# EAGLE design dRGBblades (EAGLE 6.4)
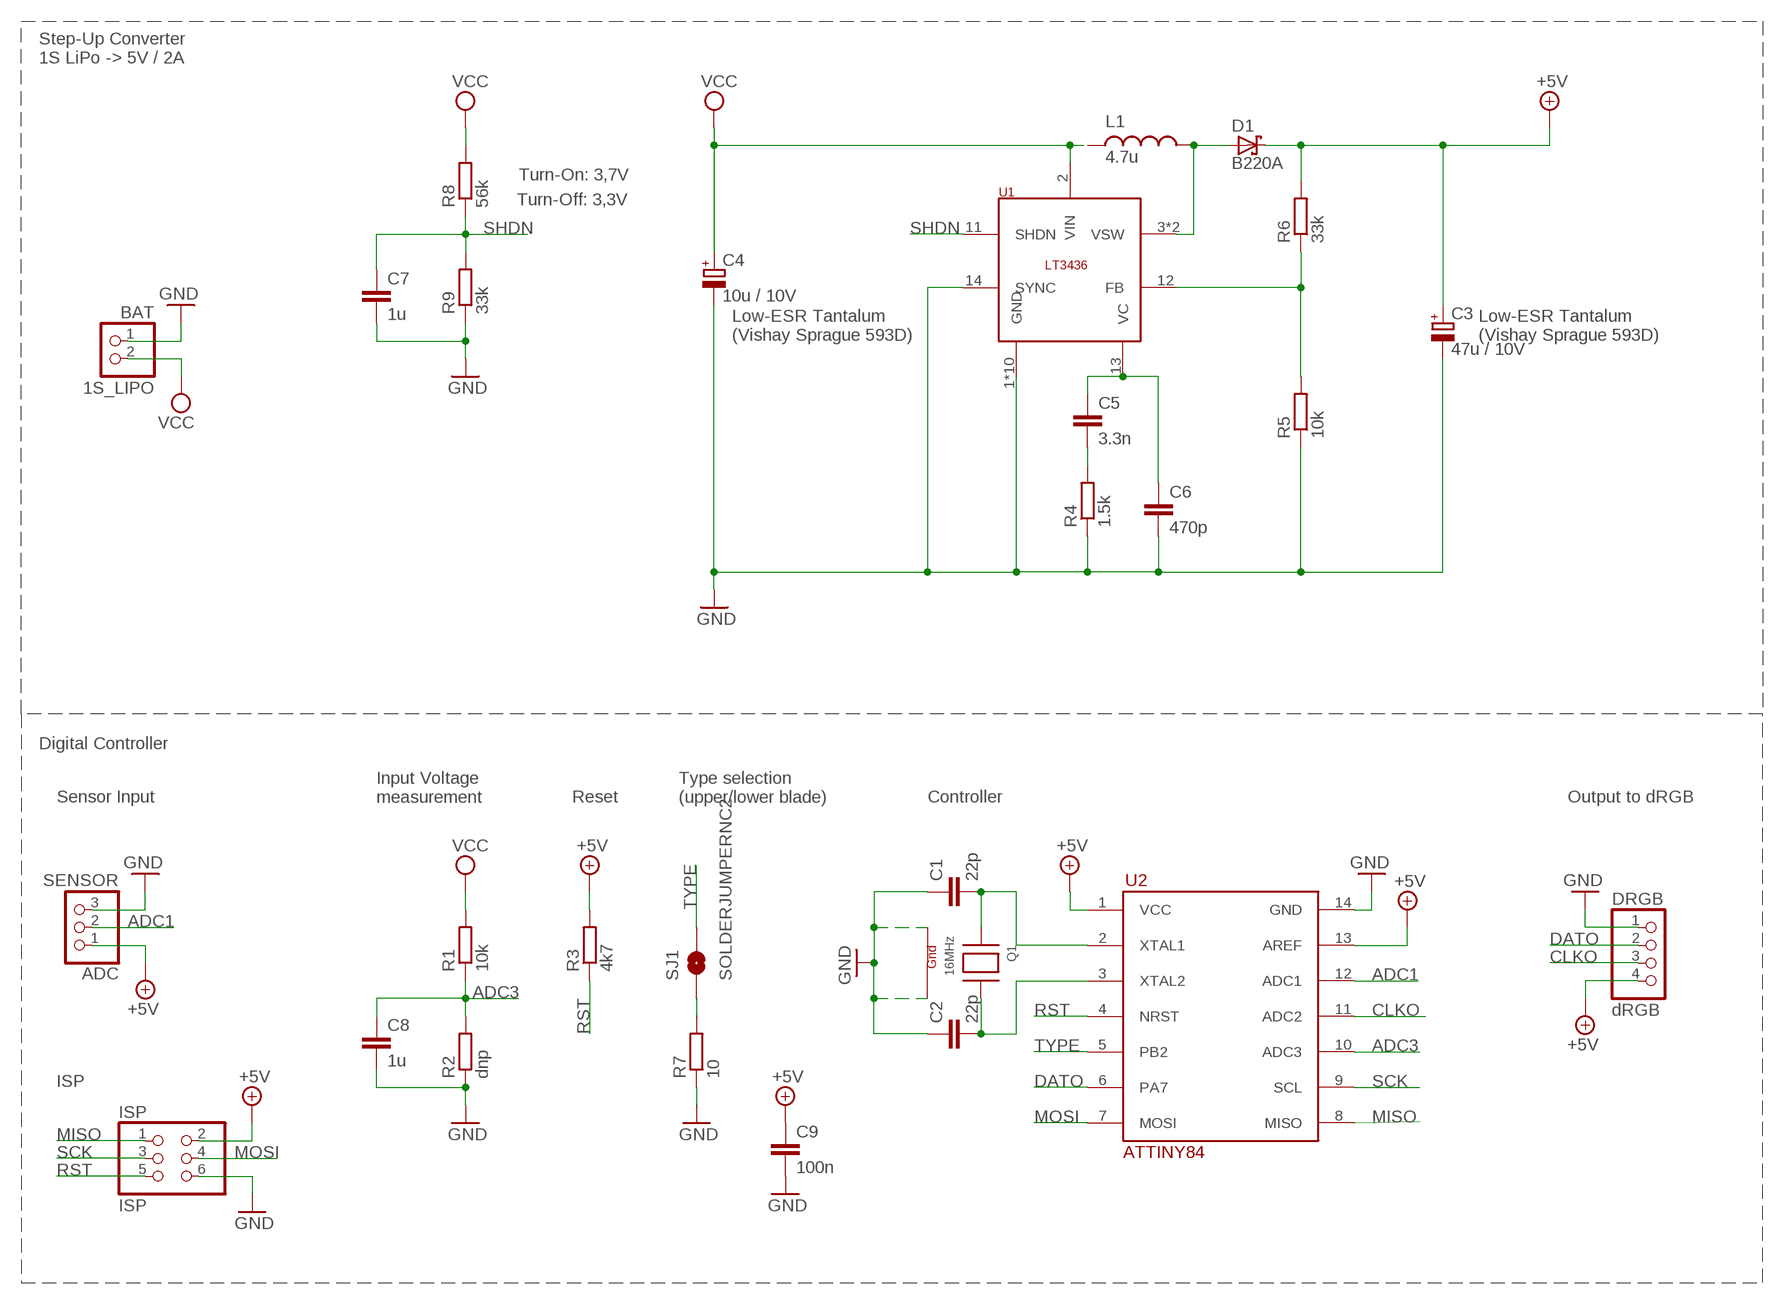
[diagram p0: schematic, sheet 1]

## Parts
ADC  SENSOR  PINHD-1X3/90  [1X03/90]
BAT  1S_LIPO  PINHD-1X2/90  [1X02/90]
C1  22p  C-EUC0603  [C0603]
C2  22p  C-EUC0603  [C0603]
C3  47u / 10V  CPOL-EUD/7343-31W  [D/7343-31W]
C4  10u / 10V  CPOL-EUA/3216-18W  [A/3216-18W]
C5  3.3n  C-EUC0603  [C0603]
C6  470p  C-EUC0603  [C0603]
C7  1u  C-EUC0603  [C0603]
C8  1u  C-EUC0603  [C0603]
C9  100n  C-EUC0603  [C0603]
D1  B220A  [SMA]
DRGB  dRGB  PINHD-1X4/90  [1X04/90]
ISP  ISP  PINHD-2X3/90  [2X03/90]
L1  4.7u  INDUCTOR-SUMIDA-CDRH6  [INDUCTOR-SUMIDA-CDRH6]
Q1  16MHz  XTAL-4-3225  [NX3225]
R1  10k  R-EUR0603  [R0603]
R2  dnp  R-EUR0603  [R0603]
R3  4k7  R-EUR0603  [R0603]
R4  1.5k  R-EUR0603  [R0603]
R5  10k  R-EUR0603  [R0603]
R6  33k  R-EUR0603  [R0603]
R7  10  R-EUR0603  [R0603]
R8  56k  R-EUR0603  [R0603]
R9  33k  R-EUR0603  [R0603]
SJ1  SOLDERJUMPERNC2  [SJ_2S-NOTRACE]
U1  LT3436  [TSSOP-17]
U2  ATTINY84  [SO14]

## Nets
+5V: ADC.1 C3.+ C9.1 D1.C DRGB.4 ISP.2 R3.2 R6.2 U2.1(VCC) U2.13(AREF)
ADC1: ADC.2 U2.12(ADC1)
ADC3: C8.1 R1.1 R2.2 U2.10(ADC3)
CLKO: DRGB.3 U2.11(ADC2)
DATO: DRGB.2 U2.6(PA7)
GND: ADC.3 BAT.1 C1.1 C2.1 C3.- C4.- C6.2 C7.2 C8.2 C9.2 DRGB.1 ISP.6 Q1.2(G2) Q1.4(G1) R2.1 R4.1 R5.1 R7.1 R9.1 U1.1(GND) U1.5(GND) U1.6(GND) U1.7(GND) U1.8(GND) U1.9(GND) U1.10(GND) U1.14(SYNC) U1.15(GND) U1.16(GND) U1.17(GND) U2.14(GND)
MISO: ISP.1 U2.8(MISO)
MOSI: ISP.4 U2.7(MOSI)
N$1: C5.1 C6.1 U1.13(VC)
N$2: C2.2 Q1.3(X2) U2.3(XTAL2)
N$3: C1.2 Q1.1(X1) U2.2(XTAL1)
N$4: C5.2 R4.2
N$7: D1.A L1.P$2 U1.3(VSW) U1.4(VSW)
N$8: R5.2 R6.1 U1.12(FB)
N$16: R7.2 SJ1.1
RST: ISP.5 R3.1 U2.4(NRST)
SCK: ISP.3 U2.9(SCL)
SHDN: C7.1 R8.1 R9.2 U1.11(SHDN)
TYPE: SJ1.2 U2.5(PB2)
VCC: BAT.2 C4.+ L1.P$1 R1.2 R8.2 U1.2(VIN)

## Notes on the sheet
- Step-Up Converter
  1S LiPo -> 5V / 2A
- Turn-On: 3,7V
- Turn-Off: 3,3V
- Low-ESR Tantalum
  (Vishay Sprague 593D)
- Low-ESR Tantalum
  (Vishay Sprague 593D)
- Digital Controller
- Sensor Input
- Input Voltage
  measurement
- Reset
- Type selection
  (upper/lower blade)
- Controller | Output to dRGB
- ISP

## Library data of the parts
ADC = pinhead:PINHD-1X3: PIN HEADER
BAT = pinhead:PINHD-1X2: PIN HEADER
C1 C2 C5-C9 = fr_allgemein:C-EU: CAPACITOR, European symbol
C3 C4 = rcl:CPOL-EU: POLARIZED CAPACITOR, European symbol
D1 = fr_diode:B220A
DRGB = pinhead:PINHD-1X4: PIN HEADER
ISP = pinhead:PINHD-2X3: PIN HEADER
L1 = fr_inductor:INDUCTOR-SUMIDA-CDRH6
Q1 = adafruit:XTAL-4: Classic 4-pin 3.2 x 2.5mm crystal
R1-R9 = fr_allgemein:R-EU: RESISTOR, European symbol
SJ1 = SparkFun:SOLDERJUMPER: Solder Jumper Standard SMD solder jumper. Used to automate production. Two varients : Normally Open and Normally Closed are the same, but have different paste layers. NC will have a large amount of paste and should jumper during reflow.
U1 = fr_linear:LT3436
U2 = fr_atmel:ATTINY84

## Board
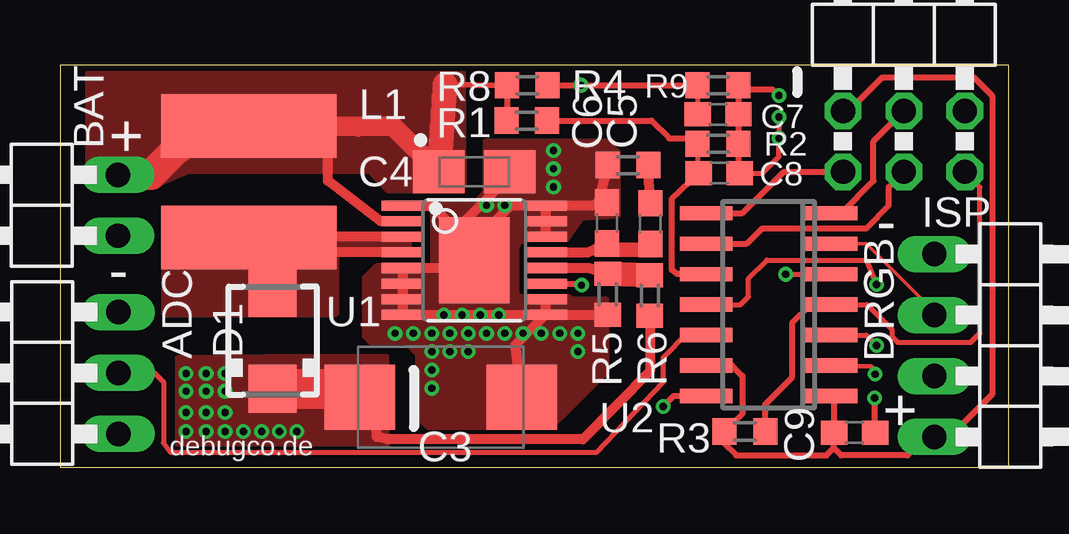
[diagram p1: board, top side]
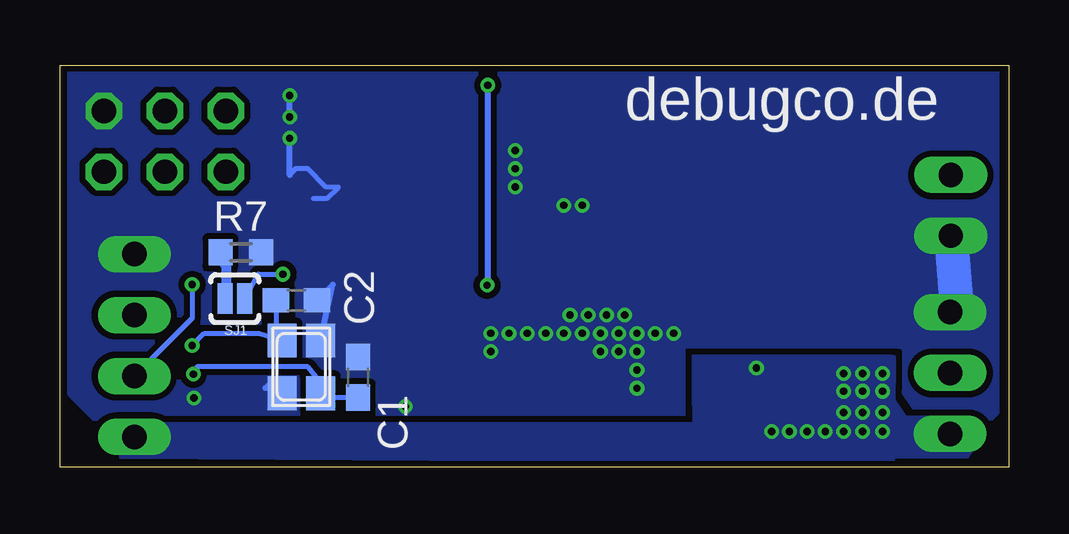
[diagram p2: board, bottom side, seen from below]

Size 39.55 x 16.75 mm. Coordinates in mm from the lower left corner, seen from the top.
Outline: 39.55,0 39.55,16.75 0,16.75 0,0 39.55,0
Copper layers (1*16): Top 0.035mm / dielectric 0.2mm / Bottom 0.035mm
Design rules "SeeedStudio_DRU_no_angle_20130527 *": minimum track width 6mil, minimum drill 12mil, track to track 6mil, track to pad 6mil, pad to pad 6mil, via to via 6mil, smd to smd 0mil, copper to edge 10mil, drill to drill 10mil, minimum pad ring 6mil, minimum via ring 6mil, stop-mask expansion 2mil, vias tented up to drill 25mil, thermal gap 10mil

### Footprints (pad centres in the part's own frame; a part is rotated, then mirrored left to right if it is on the bottom)
1X03/90 = drill 1.016 long: 1 -2.54,-3.81; 2 0,-3.81; 3 2.54,-3.81
1X02/90 = drill 1.016 long: 1 -1.27,-3.81; 2 1.27,-3.81
C0603 = smd 1.1 x 1: 1 -0.85,0; 2 0.85,0
D/7343-31W = smd 2.95 x 2.7: + 3.375,0; - -3.375,0
A/3216-18W = smd 2.15 x 1.8: + 1.475,0; - -1.475,0
SMA = smd 2 x 2: A 2,0; C -2,0
1X04/90 = drill 1.016 long: 1 -3.81,-3.81; 2 -1.27,-3.81; 3 1.27,-3.81; 4 3.81,-3.81
2X03/90 = drill 1.016 octagon: 1 -2.54,-6.35; 2 -2.54,-3.81; 3 0,-6.35; 4 0,-3.81; 5 2.54,-6.35; 6 2.54,-3.81
INDUCTOR-SUMIDA-CDRH6 = smd 7.3 x 2.65: P$1 0,0; P$2 0,4.65
NX3225 = smd 1.4 x 1.2: 1 -1.1,-0.8; 2 1.1,-0.8; 3 1.1,0.8; 4 -1.1,0.8
R0603 = smd 1 x 1.1: 1 -0.85,0; 2 0.85,0
SJ_2S-NOTRACE = smd 0.635 x 1.27: 1 -0.401,0; 2 0.413,0
TSSOP-17 = smd 0.42 x 1.78: 1 -2.275,-2.97; 2 -1.625,-2.97; 3 -0.975,-2.97; 4 -0.325,-2.97; 5 0.325,-2.97; 6 0.975,-2.97; 7 1.625,-2.97; 8 2.275,-2.97; 9 2.275,2.97; 10 1.625,2.97; 11 0.975,2.97; 12 0.325,2.97; 13 -0.325,2.97; 14 -0.975,2.97; 15 -1.625,2.97; 16 -2.275,2.97 | smd 3.581 x 2.946: 17 0,0
SO14 = smd 0.6 x 2.2: 1 -3.81,-2.6; 2 -2.54,-2.6; 3 -1.27,-2.6; 4 0,-2.6; 5 1.27,-2.6; 6 2.54,-2.6; 7 3.81,-2.6; 8 3.81,2.6; 9 2.54,2.6; 10 1.27,2.6; 11 0,2.6; 12 -1.27,2.6; 13 -2.54,2.6; 14 -3.81,2.6

### Placement (x,y rotation side)
ADC  -1.37,3.94 90 top
BAT  -1.4,10.92 90 top
C1  27.13,3.76 270 bottom
C2  29.69,6.96 180 bottom
C3  15.88,2.92 180 top
C4  17.27,12.32 180 top
C5  24.61,10.16 90 top
C6  22.81,10.19 90 top
C7  27.43,14.71 0 top
C8  27.48,12.27 0 top
C9  33.12,1.45 0 top
D1  8.86,5.28 90 top
DRGB  40.26,5.08 270 top
ISP  35.18,18.67 0 top
L1  7.87,14.22 180 top
Q1  29.49,4.19 90 bottom
R1  19.46,14.45 180 top
R2  27.43,13.49 180 top
R3  28.55,1.5 180 top
R4  23.67,12.6 0 top
R5  22.83,7.21 90 top
R6  24.59,7.16 270 top
R7  32,8.97 180 bottom
R8  19.48,15.93 180 top
R9  27.43,15.93 180 top
SJ1  32.26,7.04 0 bottom
U1  17.27,8.64 270 top
U2  29.54,6.78 90 top

### Tracks (layer width: path | path; a pad name or v marks a point on that pad's centre or on a via)
+5V  (via drill 0.3)
  Top 0.254: 11.88,3.28 C3.+ | 32.26,0.81 32.56,0.51 35.33,0.51 35.51,0.69 35.84,0.69 36.28,1.13 36.31,1.13 DRGB.4 37.08,1.27 38.86,3.05 38.86,15.49 38.1,16.26 34.29,16.26 32.89,14.86 ISP.2 | 32.26,0.81 32.26,1.43 C9.1 32.27,2.84 U2.1 | 32.26,0.81 31.95,0.51 28.19,0.51 27.69,1.02 27.69,1.52 R3.2 28.45,2.25 28.45,3.81 28.02,4.24 U2.13
  Top 0.406: R6.2 24.59,4.01 21.79,1.17 13.66,1.17 13.21,1.27 13.21,1.96 C3.+
  Top 1.676: D1.C 11.88,3.28
  other vias: 5.26,2.29 5.26,3.17 5.26,3.91 6.1,2.29 5.26,1.5 6.1,1.5 8.41,1.5 6.1,3.17 6.1,3.91 6.88,3.91 6.88,3.17 10.52,4.14 9.88,1.5 6.88,2.29 9.14,1.5 6.88,1.5 7.65,1.5
  pour Top (no thermals): 8.59,4.6 4.9,4.55 4.9,0.41 13.61,0.43 13.61,4.6
  pour Bottom (no thermals): 1.78,2.03 4.32,2.03 4.9,2.92 4.9,4.57 13.11,4.6 13.08,0.51 1.75,0.48 1.35,1.09 1.35,1.75
  pour Bottom (no thermals): 4.88,0.25 36.98,0.46 36.83,1.27 36.83,1.78 12.7,1.78 11.68,2.79 11.94,4.57 4.83,4.57
ADC1
  Top 0.203: ADC.2 3.94,3.94 4.32,3.56 4.32,1.02 4.6,0.64 22.38,0.64 25.15,3.56 25.15,4.57 26.16,5.59 26.86,5.59 U2.12
ADC3
  Top 0.203: 26.38,13.72 R2.2 26.58,12.32 C8.1
  Top 0.254: R1.1 24.66,14.45 25.4,13.72 26.38,13.72 | U2.10 25.73,8.05 25.5,8.23 25.5,11.19 C8.1
CLKO  (via drill 0.3)
  Top 0.203: U2.11 28.37,6.78 28.7,7.11 28.7,7.87 29.46,8.64 33.6,8.64 v34.04,7.62
  Bottom 0.203: v34.04,7.62 34.04,6.22 DRGB.3
DATO
  Top 0.152: U2.6 33.6,9.32 36.09,6.83 36.09,6.71 DRGB.2
GND  (via drill 0.3 pad 0.3)
  Top 0.203: 28.52,12.27 29.29,12.27 29.97,12.95 v29.97,13.72 v29.97,14.61
  Top 0.254: R9.1 C7.2 R2.1 28.28,12.32 C8.2 28.52,12.27 | C9.2 33.97,2.88 v33.96,2.9 | U2.14 25.58,2.97 v25.15,2.54 | v29.97,15.49 29.72,15.75 28.19,15.75
  Top 0.406: U1.17 16.95,8.31 U1.5 U1.6 U1.7 U1.8 U1.9 | U1.10 U1.9 | C3.- 19,5.12 U1.9 | U1.1 15.51,10.91 16.51,9.91 | 16.51,9.91 16.51,9.4 U1.17 | C4.- 18.75,12.14 16.51,9.91 | U1.16 18.79,10.91 17.53,9.65 17.53,8.89 U1.17 | U1.16 U1.15 U1.14 | U1.16 20.08,10.91 20.07,10.92 22.26,10.92 C6.2 | C6.2 22.35,10.92 | R4.1 22.44,11.1 C6.2 | U1.9 22.3,6.36 R5.1
  Bottom 0.203: 28.99,11.21 28.42,11.21 27.94,11.68 28.45,11.68 29.21,12.45 29.72,12.45 29.97,12.19
  Bottom 0.254: 2.16,6.5 ADC.3 | Q1.2 28.18,7.62 C2.1 | Q1.4 30.69,3.6 30.99,3.3 | 29.97,12.19 v29.97,13.72 | v29.97,14.61 v29.97,15.49
  Bottom 1.422: BAT.1 2.16,6.5
  other vias: 15.49,5.59 16.26,5.59 17.02,5.59 17.78,5.59 18.54,5.59 19.3,5.59 20.07,5.59 20.83,5.59 21.59,5.59 18.29,6.35 17.53,6.35 16.76,6.35 16,6.35 17.78,10.92 18.54,10.92 20.57,13.21 20.57,12.45 20.57,11.68 13.97,5.59 14.73,5.59 15.49,4.83 16.26,4.83 17.02,4.83 21.59,4.83 15.49,4.06 15.49,3.3
  pour Top (no thermals): 13.72,8.38 13.21,8.38 12.7,7.87 12.7,5.49 12.95,5.23 14.43,5.23 14.94,4.72 14.94,2.13 15.34,1.7 20.5,1.7 20.83,2.06 20.85,2.06 22.78,3.99 22.78,6.99 21.34,6.99 21.23,7.09 19.13,7.09 19.02,7.19 19.02,9.19 19.35,9.53 21.13,9.53 21.77,10.41 22.76,10.46 23.27,10.52 23.27,13.13 22.76,13.56 17.73,13.56 17.73,11.48 17.32,11 13.54,11 13.54,10.82 15.39,10.82 15.54,10.67 15.54,8.33
  pour Bottom (isolate 0.254, rank 2, no thermals): 0.51,16.51 0.51,2.29 0.76,2.03 38.1,2.03 39.12,3.05 39.12,16.51
MISO
  Top 0.254: U2.8 28.45,10.59 30.18,12.32 ISP.1
MOSI
  Top 0.254: U2.7 32.56,10.59 33.91,11.94 33.91,13.59 ISP.4
N$1
  Top 0.406: U1.13 22,8.96 C6.1 22.43,9.07 | 24.24,9.07 C5.1
  Top 0.61: 22.43,9.07 24.24,9.07
N$2  (via drill 0.3)
  Top 0.203: U2.3 33.6,5.51 v34.04,5.08
  Bottom 0.203: C2.2 30.54,5.54 Q1.3 31.24,5.59 33.53,5.59 v34.04,5.08
N$3  (via drill 0.3)
  Top 0.203: v33.98,3.89 33.98,3.91 33.83,4.19 32.32,4.22 U2.2
  Bottom 0.203: C1.2 28.51,2.91 Q1.1 28.69,3.54 29.21,4.19 33.83,4.19 v33.98,3.89
N$4
  Top 0.406: C5.2 24.51,12.56 R4.2
N$7
  Top 0.406: D1.A 9.63,7.82 9.23,8.22 | 9.23,8.22 L1.P$2 | U1.3 10.71,9.61 10.67,9.65 9.98,8.96 | 9.98,8.96 9.23,8.22 | U1.4 9.98,8.96
  pour Top (no thermals): 4.42,10.06 4.42,6.48 11.46,6.48 11.46,8.97 14.48,8.99 14.48,9.58 11.28,9.6 11.28,10.01
N$8
  Top 0.406: U1.12 22.05,8.31 R5.2
  Top 1.016: R5.2 R6.1
N$16
  Bottom 0.406: R7.2 32.85,8.67 32.61,8.43 32.61,7.08 SJ1.1
RST
  Top 0.203: U2.4 33.66,6.78 34.67,5.77 34.67,5.46 34.92,5.21 37.97,5.21 38.35,5.59 38.35,11.68 ISP.5
  Top 0.254: R3.1 29.4,2.63 30.53,3.76 30.53,6.02 31.29,6.78 U2.4
SCK
  Top 0.254: U2.9 28.63,9.32 29.29,9.96 33.6,9.96 34.54,10.92 34.54,11.68 ISP.3
SHDN  (via drill 0.3 pad 0.3)
  Top 0.203: R9.2 C7.1
  Top 0.254: U1.11 21.68,7.66 v21.74,7.59 | R8.1 v21.72,15.93 R9.2
  Bottom 0.254: v21.72,15.93 21.72,7.62 v21.74,7.59
TYPE  (via drill 0.3)
  Top 0.203: v30.25,8.05 U2.5
  Bottom 0.203: SJ1.2 31.29,8.06 v30.25,8.05
VCC
  Top 0.203: 18.63,14.48 R1.2
  Top 0.254: 16.05,15.96 R8.2 18.63,14.48
  Top 0.406: U1.2 13.36,10.26 11.18,11.94 11.18,13.97 11.43,14.22 | 12.45,13.97 12.19,14.22
  Top 0.813: L1.P$1 11.43,14.22 12.19,14.22 13.89,14.22 C4.+
  Top 1.016: C4.+ 16.05,15.96
  Top 1.27: BAT.2 3.81,12.19 5.84,14.22 L1.P$1
  pour Top (no thermals): 1.17,16.41 16.79,16.46 16.81,11.76 1.3,15.44 1.19,15.47
  pour Top (no thermals): 1.27,15.49 1.27,11.79 3.73,11.76 5.33,12.45 12.95,12.45 13.74,11.61 16.66,11.63 16.76,13.72 16,13.72 14.99,14.73 5.59,14.73 4.83,15.49

### Text on the board
tNames: + | - | - | + | debugco.de
bNames: debugco.de